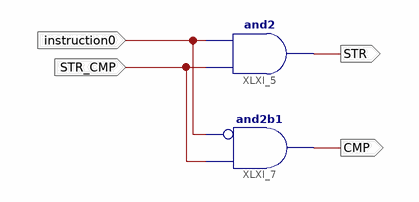
[diagram p0: schematic sheet 1]
// Xilinx ISE schematic STR_CMP.sch (spartan6) as structural Verilog: 2 symbols, 4 ports
module STR_CMP (
  input  instruction0,
  input  STR_CMP,
  output STR,
  output CMP
);

  and XLXI_5 (STR, STR_CMP, instruction0);
  and XLXI_7 (CMP, ~instruction0, STR_CMP);  // and2b1
endmodule
